# Altium project BBjarni.PrjPcb
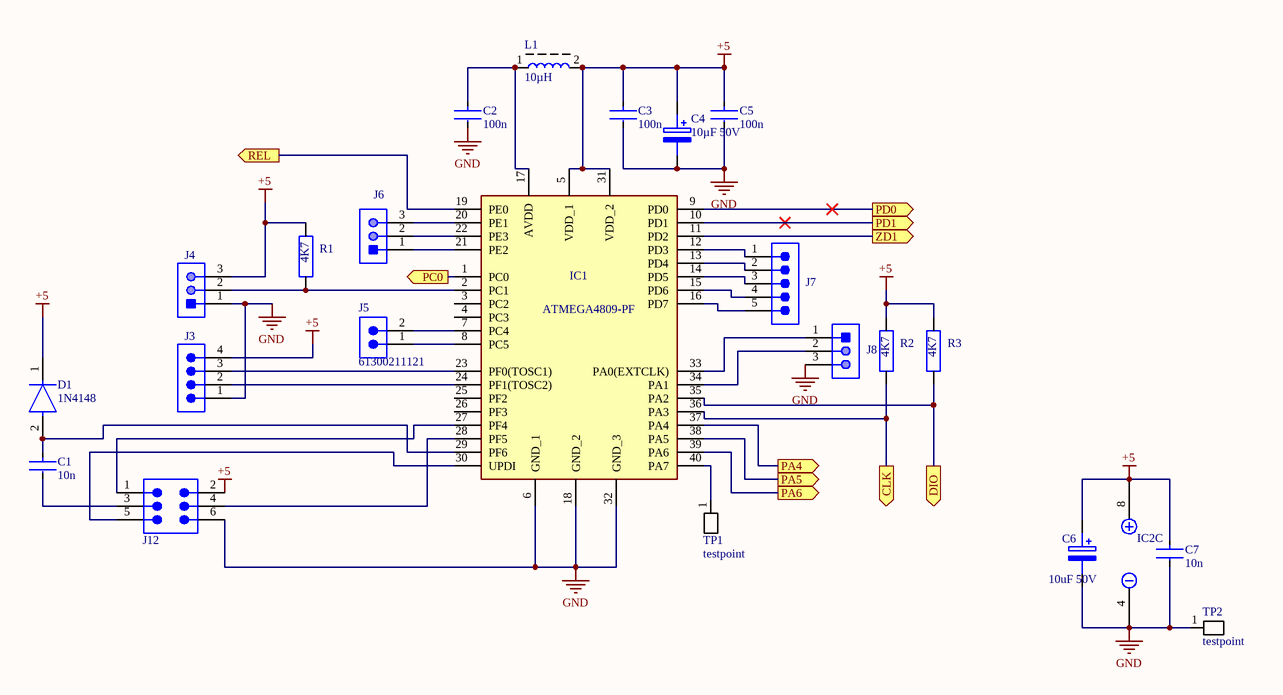
[diagram p0: CPU.SchDoc]
5 sheets, 82 parts. Net scope: flat (ports and power ports of the same name join across sheets).
Board file: PCB1bjarni.PcbDoc
Sheets:
  CPU.SchDoc
  Display.SchDoc
  SolBoutin.SchDoc
  SolBoutout.SchDoc
  Bat 20Vvoeding.SchDoc

## Sheet CPU.SchDoc
size A4; SheetNumber: 1; SheetTotal: 5

### Parts
C1  10n  [FP-C0805C-DN-IPC_A]
C2  100n  [FP-C0805C-DN-IPC_B]
C3  100n  [FP-C0805C-DN-IPC_A]
C4  10µF 50V  [caprad100mil]
C5  100n  [FP-C0805C-DN-IPC_A]
C6  10uF 50V  [caprad100mil]
C7  10n  [FP-C0805C-DN-IPC_A]
D1  1N4148  [FP-017AG-MFG]
IC1  ATMEGA4809-PF  [DIP1543W58P254L5175H635Q40N]
IC2  MCP6002-E/P  [DIP8PIN]  (value not drawn)  (part C of 3)
J3  61300411121  [61300411121]  (value not drawn)
J4  22-28-4033  [MOLX-22-28-4033_V]  (value not drawn)
J5  61300211121  [61300211121]
J6  22-28-4033  [MOLX-22-28-4033_V]  (value not drawn)
J7  61300511121  [61300511121]  (value not drawn)
J8  22-28-4033  [MOLX-22-28-4033_V]  (value not drawn)
J12  610106249121  [610106249121]  (value not drawn)
L1  10µH  [spoelSMD10µH]
R1  4K7  [res0805ph]
R2  4K7  [res0805ph]
R3  4K7  [res0805ph]
TP1  testpoint  [testpin]
TP2  testpoint  [testpin]

### Ports
CLK (out), DIO (out), PA4 (out), PA5 (out), PA6 (out), PC0 (out), PD0 (out), PD1 (out), REL (out), ZD1 (out)

### Nets
+5: C3.1 C4.1(+) C5.1 C6.1(+) C7.1 D1.1(C) IC1.5(VDD_1) IC1.31(VDD_2) IC2.8 J3.4 J4.3 J12.2 L1.2 R1.1 R2.1 R3.1
GND: C2.2 C3.2 C4.2(-) C5.2 C6.2(-) C7.2 IC1.6(GND_1) IC1.18(GND_2) IC1.32(GND_3) IC2.4 J3.1 J4.1 J8.3 J12.6 TP2.1(TP)
NetC1_1: C1.1 D1.2(A) IC1.29(PF6)
NetC1_2: C1.2 J12.3
NetC2_1: C2.1 IC1.17(AVDD) L1.1
NetC8_2: IC1.38(PA5) ; port PA5
NetC9_2: IC1.39(PA6) ; port PA6
NetC10_2: IC1.37(PA4) ; port PA4
NetC13_1: IC1.10(PD1) ; port PD1
NetC14_1: IC1.9(PD0) ; port PD0
NetIC1_1: IC1.1(PC0) ; port PC0
NetIC1_2: IC1.2(PC1) J4.2 R1.2
NetIC1_7: IC1.7(PC4) J5.2
NetIC1_8: IC1.8(PC5) J5.1
NetIC1_11: IC1.11(PD2) ; port ZD1
NetIC1_12: IC1.12(PD3) J7.1
NetIC1_13: IC1.13(PD4) J7.2
NetIC1_14: IC1.14(PD5) J7.3
NetIC1_15: IC1.15(PD6) J7.4
NetIC1_16: IC1.16(PD7) J7.5
NetIC1_19: IC1.19(PE0) ; port REL
NetIC1_20: IC1.20(PE1) J6.3
NetIC1_21: IC1.21(PE2) J6.1
NetIC1_22: IC1.22(PE3) J6.2
NetIC1_23: IC1.23(PF0(TOSC1)) J3.3
NetIC1_24: IC1.24(PF1(TOSC2)) J3.2
NetIC1_27: IC1.27(PF4) J12.1
NetIC1_28: IC1.28(PF5) J12.4
NetIC1_30: IC1.30(UPDI) J12.5
NetIC1_33: IC1.33(PA0(EXTCLK)) J8.1
NetIC1_34: IC1.34(PA1) J8.2
NetIC1_35: IC1.35(PA2) R3.2 ; port DIO
NetIC1_36: IC1.36(PA3) R2.2 ; port CLK
NetIC1_40: IC1.40(PA7) TP1.1(TP)

Not connected (* = marked no-connect by the designer): IC1 3(PC2) 4(PC3) 25(PF2) 26(PF3)

### Library data of the parts
C1-C3 C5 C7 = CMP-2007-00259-2: CAP CER 10000PF 200V X7R 0805; Manufacturer Part Number: C0805C103K2RACTU; Manufacturer: KEMET; Material: Ceramic; Temperature Coefficient: 30ppm/°C; Capacitance: 10,000 pF; Tolerance: 0.1; Value: 10,000 pF; Device Class L2: Capacitors; Voltage Rating: 200 V; Temperature Range High: +125°C; ComponentLink2Description: Datasheet; Height: 0.88mm; Octopart: https://octopart.com/c0805c103k2ractu-kemet-9138347; ComponentLink2URL: https://content.kemet.com/datasheets/KEM_C1003_C0G_SMD.pdf; Category: Cap; Temperature: -55°C to +125°C; Temperature Range Low: -55°C; Digikey Description: CAP CER 10000PF 200V X7R 0805; Temperature Characteristic: X7R; Automotive: No; Device Class L3: Ceramic Capacitors; Mouser Description: KEMET - C0805C103K2RACTU - CAP, MLCC, X7R, 10NF, 200V, 0805; RoHS: TRUE; Device Class L1: Passive Components; Lead Free: Yes; Package: C0805C-DN; Ipc Land Pattern Name: CAPC200125X78
C4 C6 = ELCO220uF: Capacitor Polarised; Manufacturer_Name: Kemet; Manufacturer_Part_Number: T494D227K006AT; Datasheet Link: https://datasheet.datasheetarchive.com/originals/distributors/Datasheets-DGA21/1893029.pdf; Height: 3.1mm; Mouser Part Number: 80-T494D227K006; Mouser Price/Stock: https://www.mouser.co.uk/ProductDetail/KEMET/T494D227K006AT/?qs=KZyWKl2lJVCDSHmnBye8LQ%3D%3D
D1 = CMP-07163-000046-1: DIODE GEN PURP 100V 200MA DO35; Forward Voltage: 1V; Max Power Dissipation: 500mW; Max Reverse Current: 5uA; Forward Current: 300mA; Current: 4A; Reverse Recovery Time: 4ns; Element Configuration: Single; Outside Diameter: 1.85mm; Capacitance: 4pF; Polarity: Standard; Max Forward Surge Current (Ifsm): 1A; Reverse Voltage: 100V; Output Current: 200mA; Average Rectified Current: 200mA; Diameter: 1.91mm; Max Repetitive Reverse Voltage (Vrrm): 100V; Current Rating: 200mA; Case/Package: DO-35; Lead Free: Lead Free; Number of Pins: 2; Recovery Time: 4ns; Packaging: Bulk; Contact Plating: Tin; Voltage: 100V; Mount: Through Hole; Max Surge Current: 4A; Package Quantity: 2000; Width: 1.91mm; Max Reverse Voltage (DC): 100V; Length: 4.56mm; Radiation Hardening: No; Power Dissipation: 500mW; Voltage Rating (DC): 100V; Peak Non-Repetitive Surge Current: 4A; REACH SVHC: No SVHC; Height: 4.56mm; Max Operating Temperature: 175°C; Series: -; Weight: 0.01lb; Min Operating Temperature: -65°C
IC1 = ATMEGA4809-PF: Integrated Circuit; Manufacturer_Name: Microchip; Datasheet Link: http://ww1.microchip.com/downloads/en/DeviceDoc/40-pin-Data-Sheet-megaAVR-0-series-DS40002104A.pdf; Height: 6.35mm; Manufacturer_Part_Number: ATMEGA4809-PF; Mouser Part Number: 556-ATMEGA4809-PF; Mouser Price/Stock: https://www.mouser.co.uk/ProductDetail/Microchip-Technology-Atmel/ATMEGA4809-PF?qs=T3oQrply3y9UlpZbCygk%252BQ%3D%3D
IC2 = AMP-OPA-MCP6002-IL8: None; Slew Rate: 0.6V/µs; Supply Current: 100uA; Power Supply Rejection Ratio (PSRR): 86dB; Input Offset Voltage (Vos): 4.5mV; Input Bias Current: 1pA; Amplifier Type: GENERAL PURPOSE; Unity Gain Bandwidth Product: 1MHz; Number of Circuits: 2; Output Current: 23mA; Operating Supply Voltage: 5.5V; Min Supply Voltage: 1.8V; Common Mode Rejection Ratio: 60dB; Voltage Gain: 112dB; Max Supply Voltage: 6V; Package Quantity: 60; REACH SVHC: No SVHC; Min Operating Temperature: -40°C; Max Operating Temperature: 125°C; Mount: Through Hole; Nominal Supply Current: 100uA; Height: 3.3mm; Length: 9.27mm; Slew Rate-Nom: 0.6V/µs; Packaging: Rail/Tube; Output Current per Channel: 23mA; Number of Amplifiers: 2; RoHS Compliant: Yes; Radiation Hardening: No; Bandwidth: 1MHz; Lead Free: Lead Free; Width: 6.35mm; Number of Channels: 2; Gain Bandwidth Product: 1MHz; Technology: CMOS; Operating Supply Current: 100uA; Number of Elements: 2; Number of Pins: 8; Input Offset Voltage-Max: 4.5mV; Case/Package: PDIP
J3 = CMP-1502-01064-2: NexarPartId: 32855522; Gender: Male; Contact Resistance: 20mΩ; Pitch: 2.54mm; Number of Contacts: 4; Current Rating: 3A; Connector Type: Male Pin; Voltage Rating: 250V; Packaging: Bulk; Orientation: Vertical; Lead Free: Lead Free; Contact Plating: Gold; Max Operating Temperature: 105°C; Height: 8.89mm; Contact Mating Length: 5.9944mm; Contact Material: Copper; Lead Pitch: 2.54mm; Min Operating Temperature: -40°C; Termination: Solder; Color: Black; Number of Rows: 1; REACH SVHC: Unknown; RoHS: Compliant; Mount: Through Hole; Number of Positions: 4; Number of Pins: 4; Operating Supply Voltage: 250V
J4 J6 J8 = CMP-1676-00001-5: Male Header, Pitch 2.54 mm, 1 x 3 Position, Height 8.38 mm, Tail Length 3.18 mm, RoHS, Bulk; Manufacturer: Molex; Rows: 1; Voltage Rating: 250 V; Current Rating: 4 A; Min Operating Temperature: 0 degC; Lead Pitch: 0.1 inch; Packaging: Bulk; Contact Finish: Gold; RoHSCompliant: true; Contact Material: Brass; PackageReference: 22-28-4033; REACH SVHC: Unknown; PackageDescription: Male Header, Pitch 2.54 mm, 1 x 3 Position, Height 8.38 mm, Tail Length 3.18 mm; ComponentLink2URL: http://www.molex.com/pdm_docs/sd/022284033_sd.pdf; Height: 8.38 mm; Mounting Technology: Through Hole; ComponentLink1Description: Manufacturer URL; Length: 7.62 mm; Mount: Through Hole; DatasheetVersion: Rev. G, 01/2012; Max Operating Temperature: 75 degC; ComponentLink2Description: Datasheet; Colour: Black; Pins: 3; Contact Plating: Gold; Package Quantity: 1; ComponentLink1URL: http://www.molex.com/
J5 = CMP-1712-00002-5: NexarPartId: 20081794; Gender: Male; Pitch: 2.54mm; Contact Resistance: 20mΩ; Operating Supply Voltage: 250V; Current Rating: 3A; Number of Contacts: 2; Connector Type: Male Pin; Orientation: Vertical; Packaging: Bulk; Contact Plating: Gold; Contact Material: Copper; Number of Pins: 2; Min Operating Temperature: -40°C; Lead Pitch: 2.54mm; Mount: Through Hole; RoHS: Compliant; REACH SVHC: No SVHC; Height: 8.94mm; Termination: Through Hole; Number of Positions: 2; Contact Mating Length: 5.9944mm; Color: Black; Contact Gender: Male; Number of Rows: 1; Housing Material: PBT; Lead Free: Lead Free; Voltage Rating: 250V; Max Operating Temperature: 125°C
J7 = CMP-1502-01068-2: NexarPartId: 32855526; Contact Resistance: 20mΩ; Pitch: 2.54mm; Gender: Male; Operating Supply Voltage: 250V; Number of Contacts: 5; Connector Type: Male Pin; Current Rating: 3A; Orientation: Vertical; Packaging: Bulk; Termination: Solder; RoHS: Compliant; Lead Pitch: 2.54mm; Contact Mating Length: 5.9944mm; Number of Positions: 5; Lead Free: Lead Free; Contact Plating: Gold; Number of Pins: 5; Min Operating Temperature: -40°C; Voltage Rating: 250V; Color: Black; Mount: Through Hole; REACH SVHC: Unknown; Height: 8.89mm; Number of Rows: 1; Contact Material: Copper; Max Operating Temperature: 105°C
J12 = CMP-1502-01146-2: NexarPartId: 52645089; Contact Resistance: 20mΩ; Gender: Male; Pitch: 2.54mm; Connector Type: Male Pin; Number of Contacts: 6; Current Rating: 3A; Operating Supply Voltage: 250V; Packaging: Tape and Reel; Contact Plating: Gold; Mount: Surface Mount; RoHS: Compliant; REACH SVHC: Unknown; Lead Pitch: 2.54mm; Termination: Solder; Color: Black; Contact Mating Length: 5.9944mm; Number of Positions: 6; Number of Rows: 2; Number of Pins: 6; Row Spacing: 2.54mm
L1 = Spoel_1
R1-R3 = Res: Resistor; Manufacturer_Name: TE Connectivity; Manufacturer_Part_Number: CPF0201D10K2C1; Datasheet Link: http://www.te.com/commerce/DocumentDelivery/DDEController?Action=showdoc&DocId=Data+Sheet%7F1773200-1%7FA%7Fpdf%7FEnglish%7FENG_DS_1773200-1_A.pdf%7F4-2176215-6; Height: 0.28mm; Mouser Part Number: N/A; Mouser Price/Stock: https://www.mouser.com/Search/Refine.aspx?Keyword=N%2FA

## Sheet Display.SchDoc
size A4; SheetNumber: 2; SheetTotal: 5
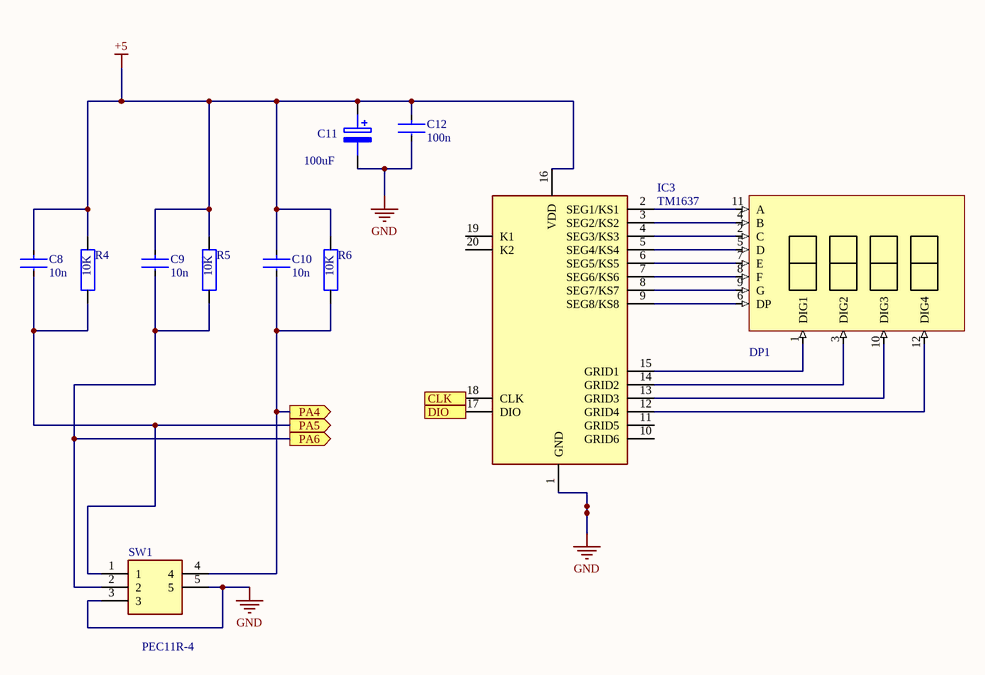
[diagram p1: Display.SchDoc]

### Parts
C8  10n  [FP-C0805C-DN-IPC_A]
C9  10n  [FP-C0805C-DN-IPC_A]
C10  10n  [FP-C0805C-DN-IPC_A]
C11  100uF  [caprad100mil]
C12  100n  [FP-C0805C-DN-IPC_A]
DP1  ELCO220uF  [display]  (value not drawn)
IC3  TM1637  [DIP778W53P254L2612H431Q20N]
R4  10K  [res0805ph]
R5  10K  [res0805ph]
R6  10K  [res0805ph]
SW1  PEC11R-4  [PEC12R-4XXXF-SXXXX_1]

### Ports
CLK (out), DIO (out), PA4 (out), PA5 (out), PA6 (out)

### Nets
+5: C8.1 C9.1 C10.1 C11.1(+) C12.1 IC3.16(VDD) R4.1 R5.1 R6.1
GND: C11.2(-) C12.2 IC3.1(GND) SW1.3 SW1.5
NetC8_2: C8.2 R4.2 SW1.1 ; port PA5
NetC9_2: C9.2 R5.2 SW1.2 ; port PA6
NetC10_2: C10.2 R6.2 SW1.4 ; port PA4
NetDP1_1: DP1.1(DIG1) IC3.15(GRID1)
NetDP1_2: DP1.2(C) IC3.4(SEG3/KS3)
NetDP1_3: DP1.3(DIG2) IC3.14(GRID2)
NetDP1_4: DP1.4(B) IC3.3(SEG2/KS2)
NetDP1_5: DP1.5(D) IC3.5(SEG4/KS4)
NetDP1_6: DP1.6(DP) IC3.9(SEG8/KS8)
NetDP1_7: DP1.7(E) IC3.6(SEG5/KS5)
NetDP1_8: DP1.8(F) IC3.7(SEG6/KS6)
NetDP1_9: DP1.9(G) IC3.8(SEG7/KS7)
NetDP1_10: DP1.10(DIG3) IC3.13(GRID3)
NetDP1_11: DP1.11(A) IC3.2(SEG1/KS1)
NetDP1_12: DP1.12(DIG4) IC3.12(GRID4)
NetIC1_35: IC3.17(DIO) ; port DIO
NetIC1_36: IC3.18(CLK) ; port CLK

Not connected (* = marked no-connect by the designer): IC3 10(GRID6) 11(GRID5) 19(K1) 20(K2)

### Library data of the parts
C8-C10 C12 = CMP-2007-00259-2: as C1 on sheet CPU; Device Class L2: Capacitors; Voltage Rating: 200 V; Temperature Range High: +125°C; ComponentLink2Description: Datasheet; Height: 0.88mm; Octopart: https://octopart.com/c0805c103k2ractu-kemet-9138347; ComponentLink2URL: https://content.kemet.com/datasheets/KEM_C1003_C0G_SMD.pdf; Category: Cap; Temperature: -55°C to +125°C; Temperature Range Low: -55°C; Digikey Description: CAP CER 10000PF 200V X7R 0805; Temperature Characteristic: X7R; Automotive: No; Device Class L3: Ceramic Capacitors; Mouser Description: KEMET - C0805C103K2RACTU - CAP, MLCC, X7R, 10NF, 200V, 0805; RoHS: TRUE; Device Class L1: Passive Components; Lead Free: Yes; Package: C0805C-DN; Ipc Land Pattern Name: CAPC200125X78
C11 = ELCO220uF: as C4 on sheet CPU; Datasheet Link: https://datasheet.datasheetarchive.com/originals/distributors/Datasheets-DGA21/1893029.pdf; Height: 3.1mm; Mouser Part Number: 80-T494D227K006; Mouser Price/Stock: https://www.mouser.co.uk/ProductDetail/KEMET/T494D227K006AT/?qs=KZyWKl2lJVCDSHmnBye8LQ%3D%3D
DP1 = Display: Capacitor Polarised; Manufacturer_Name: Kemet; Manufacturer_Part_Number: T494D227K006AT; Datasheet Link: https://datasheet.datasheetarchive.com/originals/distributors/Datasheets-DGA21/1893029.pdf; Height: 3.1mm; Mouser Part Number: 80-T494D227K006; Mouser Price/Stock: https://www.mouser.co.uk/ProductDetail/KEMET/T494D227K006AT/?qs=KZyWKl2lJVCDSHmnBye8LQ%3D%3D
IC3 = TM1637: Integrated Circuit; Manufacturer_Name: TITAN MICRO ELECTRONICS; Height: 4.31mm; Manufacturer_Part_Number: TM1637
R4-R6 = Res: as R1 on sheet CPU; Datasheet Link: http://www.te.com/commerce/DocumentDelivery/DDEController?Action=showdoc&DocId=Data+Sheet%7F1773200-1%7FA%7Fpdf%7FEnglish%7FENG_DS_1773200-1_A.pdf%7F4-2176215-6; Height: 0.28mm; Mouser Part Number: N/A; Mouser Price/Stock: https://www.mouser.com/Search/Refine.aspx?Keyword=N%2FA
SW1 = PEC11R-4225F-S0024: Undefined or Miscellaneous; Manufacturer_Name: Bourns; Datasheet Link: https://componentsearchengine.com//PEC11R-4225F-S0024.pdf; Mouser2 Part Number: 652-PEC11R-4225F-S24; Mouser2 Price/Stock: https://www.mouser.com/Search/Refine.aspx?Keyword=652-PEC11R-4225F-S24; Manufacturer_Part_Number: PEC11R-4225F-S0024

## Sheet SolBoutin.SchDoc
size A4; SheetNumber: 3; SheetTotal: 5
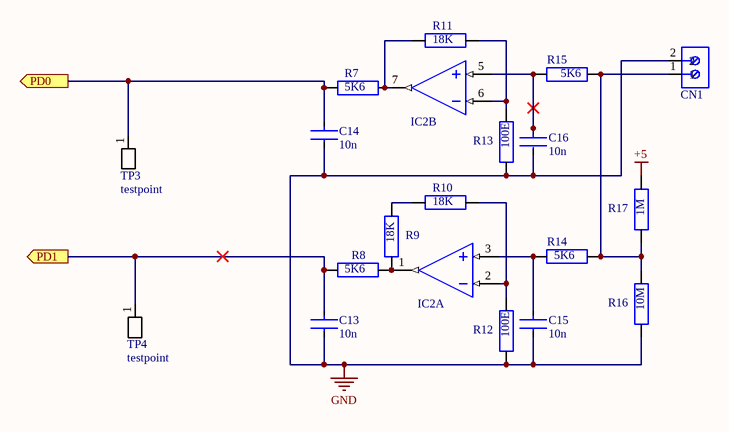
[diagram p2: SolBoutin.SchDoc]

### Parts
C13  10n  [FP-C0805C-DN-IPC_A]
C14  10n  [FP-C0805C-DN-IPC_A]
C15  10n  [FP-C0805C-DN-IPC_A]
C16  10n  [FP-C0805C-DN-IPC_A]
CN1  282836-2  [cnn2pin]  (value not drawn)
IC2  MCP6002-E/P  [DIP8PIN]  (value not drawn)  (parts A,B of 3)
R7  5K6  [res0805ph]
R8  5K6  [res0805ph]
R9  18K  [res0805ph]
R10  18K  [res0805ph]
R11  18K  [res0805ph]
R12  100E  [res0805ph]
R13  100E  [res0805ph]
R14  5K6  [res0805ph]
R15  5K6  [res0805ph]
R16  10M  [res0805ph]
R17  1M  [res0805ph]
TP3  testpoint  [testpin]
TP4  testpoint  [testpin]

### Ports
PD0 (out), PD1 (out)

### Nets
+5: R17.2
GND: C13.2 C14.2 C15.2 C16.2 CN1.2 R12.1 R13.1 R16.1
NetC13_1: C13.1 R8.2 TP4.1(TP) ; port PD1
NetC14_1: C14.1 R7.2 TP3.1(TP) ; port PD0
NetC15_1: C15.1 IC2.3(VINA+) R14.2
NetC16_1: C16.1 IC2.5(VINB+) R15.2
NetCN1_1: CN1.1 R14.1 R15.1 R16.2 R17.1
NetIC2_1: IC2.1(VOUTA) R8.1 R9.1
NetIC2_2: IC2.2(VINA-) R10.1 R12.2
NetIC2_6: IC2.6(VINB-) R11.1 R13.2
NetIC2_7: IC2.7(VOUTB) R7.1 R11.2
NetR9_2: R9.2 R10.2

### Library data of the parts
C13-C16 = CMP-2007-00259-2: as C1 on sheet CPU; Device Class L2: Capacitors; Voltage Rating: 200 V; Temperature Range High: +125°C; ComponentLink2Description: Datasheet; Height: 0.88mm; Octopart: https://octopart.com/c0805c103k2ractu-kemet-9138347; ComponentLink2URL: https://content.kemet.com/datasheets/KEM_C1003_C0G_SMD.pdf; Category: Cap; Temperature: -55°C to +125°C; Temperature Range Low: -55°C; Digikey Description: CAP CER 10000PF 200V X7R 0805; Temperature Characteristic: X7R; Automotive: No; Device Class L3: Ceramic Capacitors; Mouser Description: KEMET - C0805C103K2RACTU - CAP, MLCC, X7R, 10NF, 200V, 0805; RoHS: TRUE; Device Class L1: Passive Components; Lead Free: Yes; Package: C0805C-DN; Ipc Land Pattern Name: CAPC200125X78
CN1 = CNN2P: Female Header, Pitch 5 mm, 1 x 2 Position, Height 10 mm, Tail Length 3.5 mm, Rohs, Bulk; Manufacturer: TE Connectivity; Wire Gauge: 16-30AWG; Product Training Modules: Wire-to-BoardEurostyleTerminalBlocks; Clamp Material - Plating: Brass-NickelPlated; Voltage: 300V; Mating Orientation: HorizontalwithBoard; Current: 13.5A; Pitch: 0.197"(5.00mm); Screw Thread: M3; 3D Model: 282836-2.pdf; Other Names: 5ULV-02B / A98076; Dynamic Catalog: BuchananSeries; Number of Levels: 1; Torque - Screw: 0.68Nm(6Lb-In); Featured Product: EurostyleTerminalBlockConnectors; Positions Per Level: 2; Wire Termination: Screw-RisingCageClamp; Datasheet URL: http://www.te.com.cn/commerce/DocumentDelivery/DDEController?Action=showdoc&DocId=Catalog+Section%7F1308389_EUROSTYLE_TERMINAL_BLOCKS%7F0607%7Fpdf%7FEnglish%7FENG_CS_1308389_EUROSTYLE_TERMINAL_BLOCKS_0607.pdf%7F282836-2; Color: Green; Family: TerminalBlocks-WiretoBoard; RoHS Information: 282836-2StatementofCompliance; Standard Package: 300; Contact Material - Plating: Brass-TinPlated; Manufacturer URL: http://www.te.com; Housing Material: Polyamide(PA66),Nylon6/6; Features: Interlocking(Side); Package Description: Female Header, Pitch 5 mm, 1 x 2 Position, Height 10 mm, Tail Length 3.5 mm; Mounting Type: ThroughHole; Package Reference: THD; Packaging: Bulk; Series: Buchanan; Category: Connectors,Interconnects; Screw Material - Plating: Brass-NickelPlated
IC2 = AMP-OPA-MCP6002-IL8: as IC2 on sheet CPU; Package Quantity: 60; REACH SVHC: No SVHC; Min Operating Temperature: -40°C; Max Operating Temperature: 125°C; Mount: Through Hole; Nominal Supply Current: 100uA; Height: 3.3mm; Length: 9.27mm; Slew Rate-Nom: 0.6V/µs; Packaging: Rail/Tube; Output Current per Channel: 23mA; Number of Amplifiers: 2; RoHS Compliant: Yes; Radiation Hardening: No; Bandwidth: 1MHz; Lead Free: Lead Free; Width: 6.35mm; Number of Channels: 2; Gain Bandwidth Product: 1MHz; Technology: CMOS; Operating Supply Current: 100uA; Number of Elements: 2; Number of Pins: 8; Input Offset Voltage-Max: 4.5mV; Case/Package: PDIP
R7-R17 = Res: as R1 on sheet CPU; Datasheet Link: http://www.te.com/commerce/DocumentDelivery/DDEController?Action=showdoc&DocId=Data+Sheet%7F1773200-1%7FA%7Fpdf%7FEnglish%7FENG_DS_1773200-1_A.pdf%7F4-2176215-6; Height: 0.28mm; Mouser Part Number: N/A; Mouser Price/Stock: https://www.mouser.com/Search/Refine.aspx?Keyword=N%2FA

## Sheet SolBoutout.SchDoc
size A4; SheetNumber: 4; SheetTotal: 5
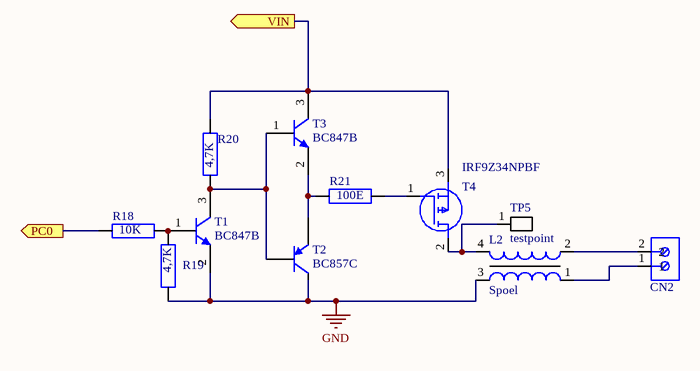
[diagram p3: SolBoutout.SchDoc]

### Parts
CN2  282836-2  [cnn2pin]  (value not drawn)
L2  Spoel  [CoilCM2545]
R18  10K  [res0805ph]
R19  4,7K  [res0805ph]
R20  4,7K  [res0805ph]
R21  100E  [res0805ph]
T1  BC847B  [sot23]
T2  BC857C  [INF-SOT23_N]
T3  BC847B  [sot23]
T4  IRF9Z34NPBF  [TO254P469X1042X1967-3P]
TP5  testpoint  [testpin]

### Ports
PC0 (out), VIN (out)

### Nets
GND: L2.3 R19.2 T1.2(E) T2.3(C)
NetC17_1: R20.1 T3.3(C) T4.3(S) ; port VIN
NetCN2_1: CN2.1 L2.1
NetCN2_2: CN2.2 L2.2
NetIC1_1: R18.1 ; port PC0
NetL2_4: L2.4 T4.2(D) TP5.1(TP)
NetR18_2: R18.2 R19.1 T1.1(B)
NetR20_2: R20.2 T1.3(C) T2.1(B) T3.1(B)
NetR21_1: R21.1 T4.1(G)
NetR21_2: R21.2 T2.2(E) T3.2(E)

### Library data of the parts
CN2 = CNN2P: as CN1 on sheet SolBoutin; Datasheet URL: http://www.te.com.cn/commerce/DocumentDelivery/DDEController?Action=showdoc&DocId=Catalog+Section%7F1308389_EUROSTYLE_TERMINAL_BLOCKS%7F0607%7Fpdf%7FEnglish%7FENG_CS_1308389_EUROSTYLE_TERMINAL_BLOCKS_0607.pdf%7F282836-2; Color: Green; Family: TerminalBlocks-WiretoBoard; RoHS Information: 282836-2StatementofCompliance; Standard Package: 300; Contact Material - Plating: Brass-TinPlated; Manufacturer URL: http://www.te.com; Housing Material: Polyamide(PA66),Nylon6/6; Features: Interlocking(Side); Package Description: Female Header, Pitch 5 mm, 1 x 2 Position, Height 10 mm, Tail Length 3.5 mm; Mounting Type: ThroughHole; Package Reference: THD; Packaging: Bulk; Series: Buchanan; Category: Connectors,Interconnects; Screw Material - Plating: Brass-NickelPlated
R18-R21 = Res: as R1 on sheet CPU; Datasheet Link: http://www.te.com/commerce/DocumentDelivery/DDEController?Action=showdoc&DocId=Data+Sheet%7F1773200-1%7FA%7Fpdf%7FEnglish%7FENG_DS_1773200-1_A.pdf%7F4-2176215-6; Height: 0.28mm; Mouser Part Number: N/A; Mouser Price/Stock: https://www.mouser.com/Search/Refine.aspx?Keyword=N%2FA
T1 T3 = BC847: NPN Silicon AF Transistor, 45 V VCEO, 100 mA IC, SOT23, Reel, Green; Manufacturer: Infineon; VEBO (max): 6Â V; ICBO (max): 15Â nA; VCBO (max): 50Â V; IBM (max): 200Â mA; Green: TRUE; Ptot (max): 330Â mW; fT (typ): 250Â MHz; IC (max): 100Â mA; VCEO (max): 45Â V; PackageDescription: 3-Pin Small Outline Transistor Package, 1.3 x 2.9 mm Body, 0.95 mm Pitch; ComponentLink3URL: http://www.infineon.com/dgdl/SOT23-Package_Overview.pdf?folderId=db3a30431936bc4b0119532290053c66&fileId=db3a30431936bc4b0119533468123c85; PackageVersion: Apr-08; Packing: Reel; ComponentLink3Description: Package Specification; ComponentLink2URL: http://www.infineon.com/dgdl/bc847series_bc848series_bc849series_bc850series.pdf?folderId=db3a304314dca389011541d30fa21656&fileId=db3a304314dca389011541d4630a1657; ComponentLink1URL: http://www.infineon.com/; ComponentLink2Description: Datasheet; Polarity: NPN; Mounting Technology: Surface Mount; PackageReference: SOT23; ICM (max): 200Â mA; ComponentLink1Description: Manufacturer URL; PartNumber: BC847B
T2 = CMP-1177-00039-1: PNP Silicon AF Transistor, 45 V VCEO, 100 mA IC, SOT23, Reel, Green; Manufacturer: Infineon; VCBO (max): 50Â V; fT (typ): 250Â MHz; ICBO (max): 15Â nA; IC (max): 100Â mA; Green: TRUE; IBM (max): 200Â mA; VEBO (max): 5Â V; VCEO (max): 45Â V; Ptot (max): 330Â mW; PackageDescription: 3-Pin Small Outline Transistor Package, 1.3 x 2.9 mm Body, 0.95 mm Pitch; ComponentLink2Description: Datasheet; PackageReference: SOT23; ComponentLink3Description: Package Specification; ComponentLink1URL: http://www.infineon.com/; ComponentLink1Description: Manufacturer URL; Mounting Technology: Surface Mount; PackageVersion: Apr-08; ComponentLink3URL: http://www.infineon.com/dgdl/SOT23-Package_Overview.pdf?folderId=db3a30431936bc4b0119532290053c66&fileId=db3a30431936bc4b0119533468123c85; ComponentLink2URL: http://www.infineon.com/dgdl/bc857series_bc858series_bc859series_bc860series.pdf?folderId=db3a304314dca389011541d30fa21656&fileId=db3a304314dca389011541da0e3a1661; Polarity: PNP; ICM (max): 200Â mA; PartNumber: BC857C; Packing: Reel
T4 = IRF9Z34NPBF: MOSFET (P-Channel); Manufacturer_Name: Infineon; Datasheet Link: https://www.infineon.com/dgdl/irf9z34npbf.pdf?fileId=5546d462533600a40153561220af1ddd; Height: 4.69mm; Manufacturer_Part_Number: IRF9Z34NPBF; Mouser Part Number: 942-IRF9Z34NPBF; Mouser Price/Stock: https://www.mouser.co.uk/ProductDetail/Infineon-IR/IRF9Z34NPBF?qs=9%252BKlkBgLFf16a%2FvlD%252BMCtQ%3D%3D; Arrow Part Number: IRF9Z34NPBF; Arrow Price/Stock: https://www.arrow.com/en/products/irf9z34npbf/infineon-technologies-ag?region=nac

## Sheet Bat 20Vvoeding.SchDoc
size A4; SheetNumber: 5; SheetTotal: 5
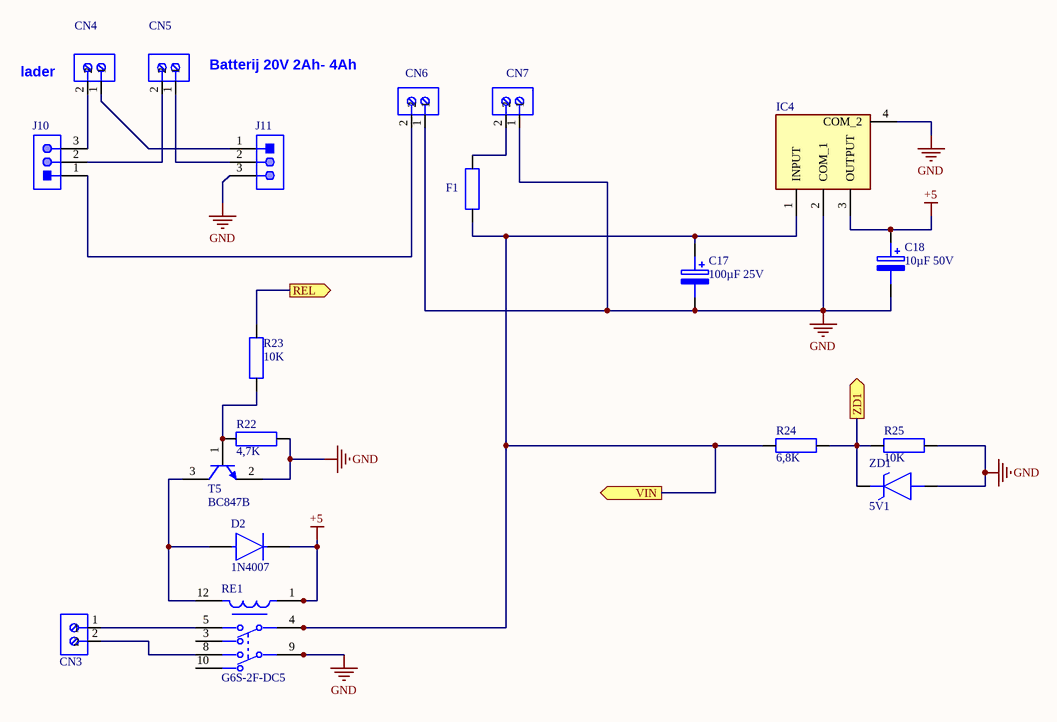
[diagram p4: Bat 20Vvoeding.SchDoc]

### Parts
C17  100µF 25V  [caprad100mil]
C18  10µF 50V  [caprad100mil]
CN3  282836-2  [cnn2pin]  (value not drawn)
CN4  282836-2  [cnn2pin]  (value not drawn)
CN5  282836-2  [cnn2pin]  (value not drawn)
CN6  282836-2  [cnn2pin]  (value not drawn)
CN7  282836-2  [cnn2pin]  (value not drawn)
D2  1N4007  [FP-1N4007-MFG]
F1  4,7K  [Fuze]  (value not drawn)
IC4  TL780-05CKTTR  [TL78005CKTTR]  (value not drawn)
J10  (no value)  [3pinsheader]
J11  (no value)  [3pinsheader]
R22  4,7K  [res0805ph]
R23  10K  [res0805ph]
R24  6,8K  [res0805ph]
R25  10K  [res0805ph]
RE1  G6S-2F-DC5  [FP-G6S-2F-DC5-MFG]
T5  BC847B  [sot23]
ZD1  5V1  [DIOAD1068W53L380D172]

### Ports
REL (out), VIN (out), ZD1 (out)

### Nets
+5: C18.1(+) D2.1(C) IC4.3(OUTPUT) RE1.1
GND: C17.2(-) C18.2(-) CN6.1 CN7.1 IC4.2(COM_1) IC4.4(COM_2) J11.3 R22.2 R25.1 RE1.9 T5.2(E) ZD1.2(A)
NetC17_1: C17.1(+) F1.1 IC4.1(INPUT) R24.1 RE1.4 ; port VIN
NetCN3_1: CN3.1 RE1.5
NetCN3_2: CN3.2 RE1.8
NetCN4_1: CN4.1 J11.1
NetCN4_2: CN4.2 J10.3
NetCN5_1: CN5.1 J11.2
NetCN5_2: CN5.2 J10.2
NetCN6_2: CN6.2 J10.1
NetCN7_2: CN7.2 F1.2
NetD2_2: D2.2(A) RE1.12 T5.3(C)
NetIC1_11: R24.2 R25.2 ZD1.1(K) ; port ZD1
NetIC1_19: R23.2 ; port REL
NetR22_1: R22.1 R23.1 T5.1(B)

Not connected (* = marked no-connect by the designer): RE1 3 10

### Notes on the sheet
- (near CN4) lader
- (near CN5) Batterij 20V 2Ah- 4Ah

### Library data of the parts
C17 C18 = ELCO220uF: as C4 on sheet CPU; Datasheet Link: https://datasheet.datasheetarchive.com/originals/distributors/Datasheets-DGA21/1893029.pdf; Height: 3.1mm; Mouser Part Number: 80-T494D227K006; Mouser Price/Stock: https://www.mouser.co.uk/ProductDetail/KEMET/T494D227K006AT/?qs=KZyWKl2lJVCDSHmnBye8LQ%3D%3D
CN3-CN7 = CNN2P: as CN1 on sheet SolBoutin; Datasheet URL: http://www.te.com.cn/commerce/DocumentDelivery/DDEController?Action=showdoc&DocId=Catalog+Section%7F1308389_EUROSTYLE_TERMINAL_BLOCKS%7F0607%7Fpdf%7FEnglish%7FENG_CS_1308389_EUROSTYLE_TERMINAL_BLOCKS_0607.pdf%7F282836-2; Color: Green; Family: TerminalBlocks-WiretoBoard; RoHS Information: 282836-2StatementofCompliance; Standard Package: 300; Contact Material - Plating: Brass-TinPlated; Manufacturer URL: http://www.te.com; Housing Material: Polyamide(PA66),Nylon6/6; Features: Interlocking(Side); Package Description: Female Header, Pitch 5 mm, 1 x 2 Position, Height 10 mm, Tail Length 3.5 mm; Mounting Type: ThroughHole; Package Reference: THD; Packaging: Bulk; Series: Buchanan; Category: Connectors,Interconnects; Screw Material - Plating: Brass-NickelPlated
D2 = CMP-123542-000001-1: Rectifier diode 1000 V 1 A DO-41, ,; Manufacturer: Diotec; Max Surge Forward Current: 27A; Forward Current: 1A; Max Junction Temp: +175°C; Reverse Voltage: 1000V; Value: 15pF; Peak Reverse Current: 5uA; Category: Diode; Temperature Range Low: -50°C; Automotive: No; Temperature: -50°C to +175°C; Lead Free: Yes; ComponentLink2Description: Datasheet; Max Repetitive Reverse Voltage: 1000V; ComponentLink2URL: https://datasheet.octopart.com/1N4007-Diotec-datasheet-62346875.pdf; Manufacturer Part Number: 1N4007; Device Class L3: Rectifier Diodes; Height: 2.8mm; Octopart: https://octopart.com/1n4007-diotec-4040411; Package: 1N4007; Temperature Range High: +175°C; Device Class L1: Discrete Semiconductors; Device Class L2: Diodes; RoHS: TRUE; Capacitance: 15pF; Ipc Land Pattern Name: DIOAD888W100L520D280
F1 = Fuze: Resistor; Manufacturer_Name: TE Connectivity; Manufacturer_Part_Number: CPF0201D10K2C1; Datasheet Link: http://www.te.com/commerce/DocumentDelivery/DDEController?Action=showdoc&DocId=Data+Sheet%7F1773200-1%7FA%7Fpdf%7FEnglish%7FENG_DS_1773200-1_A.pdf%7F4-2176215-6; Height: 0.28mm; Mouser Part Number: N/A; Mouser Price/Stock: https://www.mouser.com/Search/Refine.aspx?Keyword=N%2FA
IC4 = TL780-05CKTTR: Integrated Circuit; Manufacturer_Name: Texas Instruments; Datasheet Link: http://www.ti.com/general/docs/suppproductinfo.tsp?distId=26&gotoUrl=http%3A%2F%2Fwww.ti.com%2Flit%2Fgpn%2Ftl780; Height: 5.08mm; Manufacturer_Part_Number: TL780-05CKTTR
J10 J11 = header3pin: THT Vertical Pin Header WR-PHD, Pitch 2.54 mm, Single Row, 2 pins; Manufacturer: Wurth Elektronik; Part Number: 61300211121; Manufacturer: Wurth Electronics; Rated Current: 3A; Gender: Male; Withstanding Voltage: 500VAC; Working Voltage: 250VAC; Pitch: 2.54mm; Contact Resistance: 20mOhm; Pin Number: 2; Mounting Technology: THT; Orientation: Vertical; Operating Temperature: -40to105degC; Packaging: Bag; Publisher: WurthElektronik; Datasheet URL: https://katalog.we-online.de/em/datasheet/6130xx11121.pdf; Manufacturer URL: http://www.we-online.de; Row Number: Single; Package Reference: 61300211121; Manufacturer Part Number: 61300211121
R22-R25 = Res: as R1 on sheet CPU; Datasheet Link: http://www.te.com/commerce/DocumentDelivery/DDEController?Action=showdoc&DocId=Data+Sheet%7F1773200-1%7FA%7Fpdf%7FEnglish%7FENG_DS_1773200-1_A.pdf%7F4-2176215-6; Height: 0.28mm; Mouser Part Number: N/A; Mouser Price/Stock: https://www.mouser.com/Search/Refine.aspx?Keyword=N%2FA
RE1 = CMP-08823-000012-1: RELAY TELECOM DPDT 2A 5VDC; Manufacturer: Omron; Coil Resistance: 178Ω; Coil Current: 28.1mA; Coil Voltage: 5V; Standoff Height: 0.35mm; Coil Power: 140mW; Coil Type: Non-Latching; Number Of Contacts: 2; RoHS: TRUE; Device Class L3: Signal Relays; Ambient Temperature Range Low: -40°C; Switching Current: 2A; Device Class L1: Electromechanical; Lead Free: Yes; Category: Relay; Digikey Description: RELAY TELECOM DPDT 2A 5VDC; Height: 9.4mm; Temperature: -40°C to +85°C; Throw Configuration: DPDT; Octopart: https://octopart.com/g6s-2f-dc5-omron-85236; Package: G6S-2F-DC5; Temperature Range High: +85°C; Automotive: No; Current Rating: 2A; Manufacturer Part Number: G6S-2F-DC5; Mouser Description: Electromechanical Relay 5VDC 178Ohm 2A DPDT (14.8x9.2x9.2)mm SMD Signal Relay; Temperature Range Low: -40°C; Device Class L2: Relays; Ambient Temperature Range High: +85°C; ComponentLink2URL: https://omronfs.omron.com/en_US/ecb/products/pdf/en-g6s.pdf; ComponentLink2Description: Datasheet
T5 = BC847: as T1 on sheet SolBoutout; PackageDescription: 3-Pin Small Outline Transistor Package, 1.3 x 2.9 mm Body, 0.95 mm Pitch; ComponentLink3URL: http://www.infineon.com/dgdl/SOT23-Package_Overview.pdf?folderId=db3a30431936bc4b0119532290053c66&fileId=db3a30431936bc4b0119533468123c85; PackageVersion: Apr-08; Packing: Reel; ComponentLink3Description: Package Specification; ComponentLink2URL: http://www.infineon.com/dgdl/bc847series_bc848series_bc849series_bc850series.pdf?folderId=db3a304314dca389011541d30fa21656&fileId=db3a304314dca389011541d4630a1657; ComponentLink1URL: http://www.infineon.com/; ComponentLink2Description: Datasheet; Polarity: NPN; Mounting Technology: Surface Mount; PackageReference: SOT23; ICM (max): 200Â mA; ComponentLink1Description: Manufacturer URL; PartNumber: BC847B
ZD1 = BZX79C3V3: Zener Diode; Manufacturer_Name: ON Semiconductor; Manufacturer_Part_Number: BZX79C6V8; Datasheet Link: https://www.onsemi.com/pub/Collateral/BZX79C2V4-D.PDF; Mouser Part Number: 512-BZX79C6V8; Mouser Price/Stock: https://www.mouser.co.uk/ProductDetail/ON-Semiconductor-Fairchild/BZX79C6V8?qs=G5AQjGfRJcK7HFctFTHqog%3D%3D; Arrow Part Number: BZX79C6V8; Arrow Price/Stock: https://www.arrow.com/en/products/bzx79c6v8/on-semiconductor

## Nets that join several sheets
+5: CPU (16 pins), Display (9 pins), SolBoutin (R17.2), Bat 20Vvoeding (C18.1 D2.1 IC4.3 RE1.1)
GND: CPU (15 pins), Display (5 pins), SolBoutin (8 pins), SolBoutout (L2.3 R19.2 T1.2 T2.3), Bat 20Vvoeding (12 pins)
NetC8_2: CPU (IC1.38), Display (C8.2 R4.2 SW1.1)
NetC9_2: CPU (IC1.39), Display (C9.2 R5.2 SW1.2)
NetC10_2: CPU (IC1.37), Display (C10.2 R6.2 SW1.4)
NetC13_1: CPU (IC1.10), SolBoutin (C13.1 R8.2 TP4.1)
NetC14_1: CPU (IC1.9), SolBoutin (C14.1 R7.2 TP3.1)
NetC17_1: SolBoutout (R20.1 T3.3 T4.3), Bat 20Vvoeding (5 pins)
NetIC1_1: CPU (IC1.1), SolBoutout (R18.1)
NetIC1_11: CPU (IC1.11), Bat 20Vvoeding (R24.2 R25.2 ZD1.1)
NetIC1_19: CPU (IC1.19), Bat 20Vvoeding (R23.2)
NetIC1_35: CPU (IC1.35 R3.2), Display (IC3.17)
NetIC1_36: CPU (IC1.36 R2.2), Display (IC3.18)